# EAGLE design SonicScrewdriver-R2 (EAGLE 6.5.0)
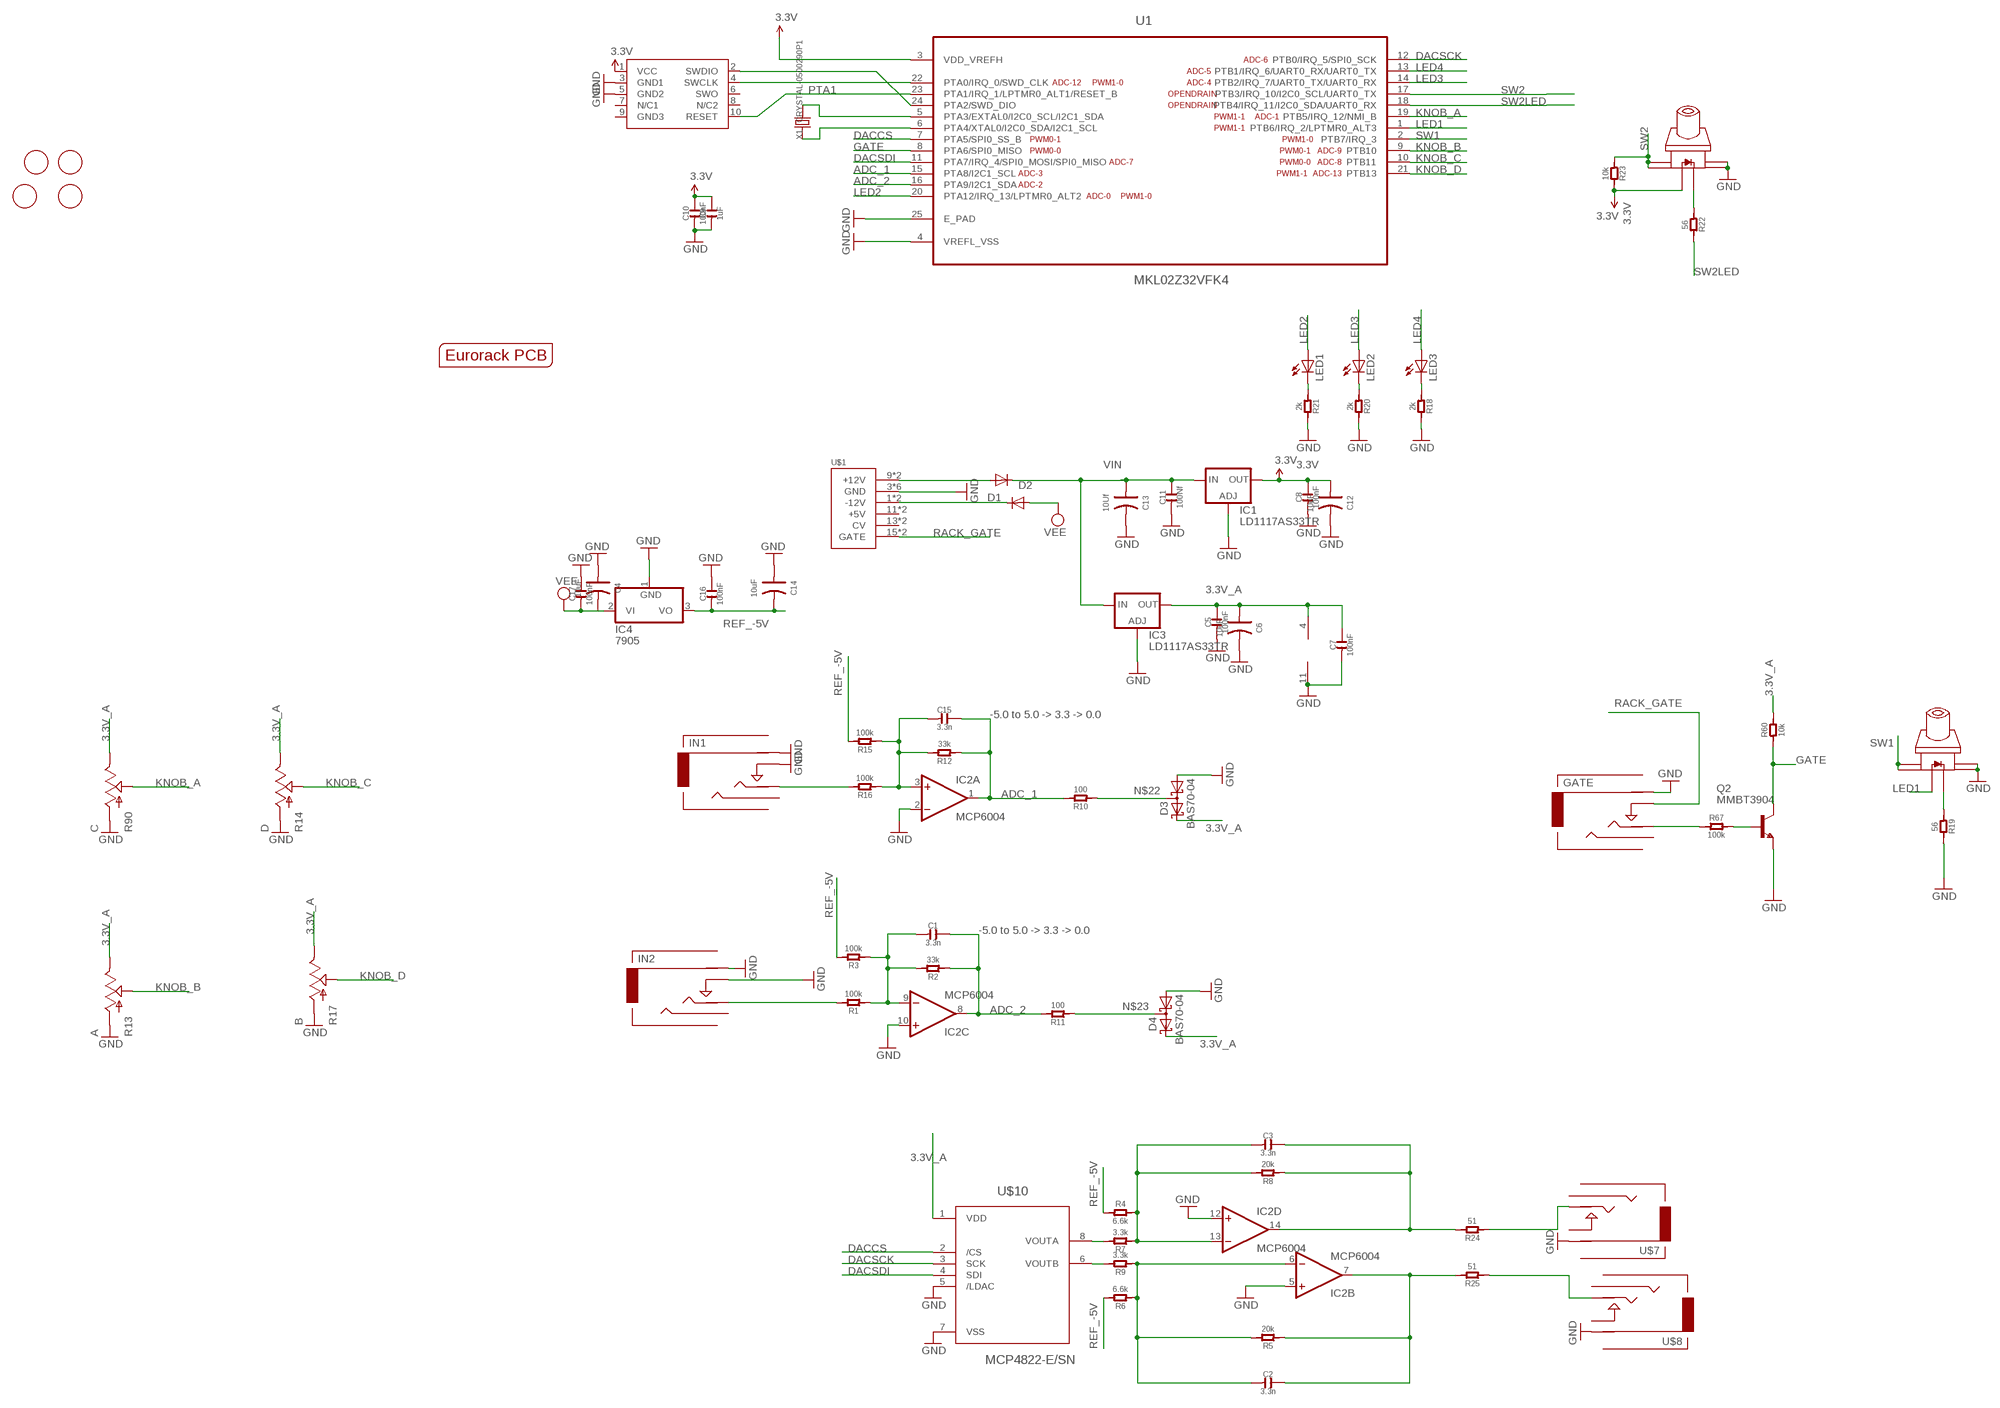
[diagram p0: schematic, sheet 1]

## Parts
C1  3.3n  C-0603  [C0603]
C2  3.3n  C-0603  [C0603]
C3  3.3n  C-0603  [C0603]
C4  10uF  C-POLAR-A  [AVX-A]
C5  100nF  C-0603  [C0603]
C6  10uF  C-POLAR-A  [AVX-A]
C7  100nF  C-0603  [C0603]
C8  100nF  C-0603  [C0603]
C9  1uF  C-0603  [C0603]
C10  100nF  C-0603  [C0603]
C11  100Nf  C-0603  [C0603]
C12  10uF  C-POLAR-A  [AVX-A]
C13  10Uf  C-POLAR-A  [AVX-A]
C14  10uF  C-POLAR-A  [AVX-A]
C15  3.3n  C-0603  [C0603]
C16  100nF  C-0603  [C0603]
C17  100nF  C-0603  [C0603]
D1  1N5819HW  DIODE-SOD123  [SOD123]
D2  1N5819HW  DIODE-SOD123  [SOD123]
D3  BAS70-04  [SOT23]
D4  BAS70-04  [SOT23]
GATE  Gate  AUDIO-JACKINPUT  [3.5MM-JACK-SWITCH-13MM-INPUT]
IC1  LD1117AS33TR  [SOT223]
IC2  MCP6004  TL074D  [SO14]
IC3  LD1117AS33TR  [SOT223]
IC4  7905  7905T  [TO220H]
IN1  In 2  AUDIO-JACKINPUT  [3.5MM-JACK-SWITCH-13MM-INPUT]
IN2  In 1  AUDIO-JACKINPUT  [3.5MM-JACK-SWITCH-13MM-INPUT]
LED1  LED3MM  [LED3MM]
LED2  LED3MM  [LED3MM]
LED3  LED3MM  [LED3MM]
Q2  MMBT3904  MMBT3904LT1-NPN-SOT23-BEC  [SOT23-BEC]
R1  100k  R-0603  [R0603]
R2  33k  R-0603  [R0603]
R3  100k  R-0603  [R0603]
R4  6.6k  R-0603  [R0603]
R5  20k  R-0603  [R0603]
R6  6.6k  R-0603  [R0603]
R7  3.3k  R-0603  [R0603]
R8  20k  R-0603  [R0603]
R9  3.3k  R-0603  [R0603]
R10  100  R-0603  [R0603]
R11  100  R-0603  [R0603]
R12  33k  R-0603  [R0603]
R13  A  POTZEPHPOT  [OG-POTS_ALPS_POT_VERTICAL]
R14  D  POTZEPHPOT  [OG-POTS_ALPS_POT_VERTICAL]
R15  100k  R-0603  [R0603]
R16  100k  R-0603  [R0603]
R17  B  POTZEPHPOT  [OG-POTS_ALPS_POT_VERTICAL]
R18  2k  R-0603  [R0603]
R19  56  R-0603  [R0603]
R20  2k  R-0603  [R0603]
R21  2k  R-0603  [R0603]
R22  56  R-0603  [R0603]
R23  10k  R-0603  [R0603]
R24  51  R-0603  [R0603]
R25  51  R-0603  [R0603]
R60  10k  R-0603  [R0603]
R67  100k  R-0603  [R0603]
R90  C  POTZEPHPOT  [OG-POTS_ALPS_POT_VERTICAL]
SWD1  CORTEX_SWD  [M50-3600542]
U1  MKL02Z32VFK4  [QFN50P400X400X100-25N]
U$1  POWER  [POWER_16]
U$2  EURORACK_PCB8HP  [EURORACK8HPPCB]
U$3  SWITCH_W_LED_PB6149L-X-102WHITE  [PB6149L]
U$4  FIDUCIAL  [FIDUCIAL_1MM]
U$5  FIDUCIAL  [FIDUCIAL_1MM]
U$6  SWITCH_W_LED_PB6149L-X-102WHITE  [PB6149L]
U$7  Out 2  AUDIO-JACKOUTPUT  [3.5MM-JACK-SWITCH-13MM-OUTPUT]
U$8  Out 1  AUDIO-JACKOUTPUT  [3.5MM-JACK-SWITCH-13MM-OUTPUT]
U$9  FIDUCIAL  [FIDUCIAL_1MM]
U$10  MCP4822-E/SN  [SOIC8-N_MC]
U$11  FIDUCIAL  [FIDUCIAL_1MM]
X1  CRYSTAL-0500290P1  [2P-SMD-5.0X3.2]

## Nets
3.3V: C8.2 C9.2 C10.2 C12.+ IC1.2(OUT) IC1.4(OUT) R23.2 SWD1.1(VCC) U1.3(VDD_VREFH) U$3.LEDPOS(POS)
3.3V_A: C5.2 C6.+ C7.2 D3.2(C2) D4.2(C2) IC2.4(P:V+) IC3.2(OUT) IC3.4(OUT) R13.P$1(E) R14.P$1(E) R17.P$1(E) R60.2 R90.P$1(E) U$10.1(VDD)
ADC_1: C15.2 IC2.1(A:OUT) R10.2 R12.1 U1.15(PTA8/I2C1_SCL)
ADC_2: C1.2 IC2.8(C:OUT) R2.1 R11.2 U1.16(PTA9/I2C1_SDA)
DACCS: U1.7(PTA5/SPI0_SS_B) U$10.2(/CS)
DACSCK: U1.12(PTB0/IRQ_5/SPI0_SCK) U$10.3(SCK)
DACSDI: U1.11(PTA7/IRQ_4/SPI0_MOSI/SPI0_MISO) U$10.4(SDI)
GATE: Q2.C R60.1 U1.8(PTA6/SPI0_MISO)
GND: C4.+ C5.1 C6.- C7.1 C8.1 C9.1 C10.1 C11.1 C12.- C13.- C14.+ C16.2 C17.2 D3.1(A1) D4.1(A1) GATE.RING@1(RING) GATE.RING@2(RING) IC1.1(ADJ) IC2.2(A:-IN) IC2.5(B:+IN) IC2.10(C:+IN) IC2.11(P:V-) IC2.12(D:+IN) IC3.1(ADJ) IC4.1(GND) IN1.RING@1(RING) IN1.RING@2(RING) IN1.SWITCH@1(SWITCH) IN1.SWITCH@2(SWITCH) IN2.RING@1(RING) IN2.RING@2(RING) IN2.SWITCH@1(SWITCH) IN2.SWITCH@2(SWITCH) Q2.E R13.P$3(A) R14.P$3(A) R17.P$3(A) R18.2 R19.2 R20.2 R21.2 R90.P$3(A) SWD1.3(GND1) SWD1.5(GND2) U1.4(VREFL_VSS) U1.25(E_PAD) U$1.3(GND) U$1.4(GND) U$1.5(GND) U$1.6(GND) U$1.7(GND) U$1.8(GND) U$3.3 U$3.4 U$6.3 U$6.4 U$7.RING@1(RING) U$7.RING@2(RING) U$8.RING@1(RING) U$8.RING@2(RING) U$10.5(/LDAC) U$10.7(VSS)
KNOB_A: R90.P$2(S) U1.19(PTB5/IRQ_12/NMI_B)
KNOB_B: R13.P$2(S) U1.9(PTB10)
KNOB_C: R14.P$2(S) U1.10(PTB11)
KNOB_D: R17.P$2(S) U1.21(PTB13)
LED1: U1.1(PTB6/IRQ_2/LPTMR0_ALT3) U$6.LEDPOS(POS)
LED2: LED1.A U1.20(PTA12/IRQ_13/LPTMR0_ALT2)
LED3: LED2.A U1.14(PTB2/IRQ_7/UART0_TX/UART0_RX)
LED4: LED3.A U1.13(PTB1/IRQ_6/UART0_RX/UART0_TX)
N$1: U1.5(PTA3/EXTAL0/I2C0_SCL/I2C1_SDA) X1.2
N$2: U1.6(PTA4/XTAL0/I2C0_SDA/I2C1_SCL) X1.1
N$3: IN1.TIP@1(TIP) IN1.TIP@2(TIP) R16.2
N$4: C15.1 IC2.3(A:+IN) R12.2 R15.1 R16.1
N$5: SWD1.4(SWCLK) U1.22(PTA0/IRQ_0/SWD_CLK)
N$6: IN2.TIP@1(TIP) IN2.TIP@2(TIP) R1.2
N$7: SWD1.2(SWDIO) U1.24(PTA2/SWD_DIO)
N$8: C1.1 IC2.9(C:-IN) R1.1 R2.2 R3.1
N$9: C2.1 IC2.6(B:-IN) R5.2 R6.1 R9.1
N$10: C3.1 IC2.13(D:-IN) R4.2 R7.1 R8.2
N$11: R7.2 U$10.8(VOUTA)
N$12: R9.2 U$10.6(VOUTB)
N$13: D1.A U$1.9(+12V) U$1.10(+12V)
N$14: R19.1 U$6.LEDNEG(NEG)
N$15: LED3.K(C) R18.1
N$16: LED2.K(C) R20.1
N$17: LED1.K(C) R21.1
N$18: C3.2 IC2.14(D:OUT) R8.1 R24.2
N$19: R22.1 U$3.LEDNEG(NEG)
N$20: R25.1 U$8.TIP@1(TIP) U$8.TIP@2(TIP)
N$21: R24.1 U$7.TIP@1(TIP) U$7.TIP@2(TIP)
N$22: D3.3(C1A2) R10.1
N$23: D4.3(C1A2) R11.1
N$24: C2.2 IC2.7(B:OUT) R5.1 R25.2
N$43: GATE.TIP@1(TIP) GATE.TIP@2(TIP) R67.1
N$64: D2.C U$1.1(-12V) U$1.2(-12V)
N$66: Q2.B R67.2
PTA1: SWD1.10(RESET) U1.23(PTA1/IRQ_1/LPTMR0_ALT1/RESET_B)
RACK_GATE: GATE.SWITCH@1(SWITCH) GATE.SWITCH@2(SWITCH) U$1.15(GATE) U$1.16(GATE)
REF_-5V: C14.- C16.1 IC4.3(VO) R3.2 R4.1 R6.2 R15.2
SW1: U1.2(PTB7/IRQ_3) U$6.1 U$6.2
SW2: R23.1 U1.17(PTB3/IRQ_10/I2C0_SCL/UART0_TX) U$3.1 U$3.2
SW2LED: R22.2 U1.18(PTB4/IRQ_11/I2C0_SDA/UART0_RX)
VEE: C4.- C17.1 D2.A IC4.2(VI)
VIN: C11.2 C13.+ D1.C IC1.3(IN) IC3.3(IN)
Unconnected: GATE.SECOND@1(SECOND) GATE.SECOND@2(SECOND) IN1.SECOND@1(SECOND) IN1.SECOND@2(SECOND) IN2.SECOND@1(SECOND) IN2.SECOND@2(SECOND) SWD1.6(SWO) SWD1.7(N/C1) SWD1.8(N/C2) SWD1.9(GND3) U$1.11(+5V) U$1.12(+5V) U$1.13(CV) U$1.14(CV) U$7.SECOND@1(SECOND) U$7.SECOND@2(SECOND) U$7.SWITCH@1(SWITCH) U$7.SWITCH@2(SWITCH) U$8.SECOND@1(SECOND) U$8.SECOND@2(SECOND) U$8.SWITCH@1(SWITCH) U$8.SWITCH@2(SWITCH)

## Notes on the sheet
- -5.0 to 5.0 -> 3.3 -> 0.0
- -5.0 to 5.0 -> 3.3 -> 0.0

## Library data of the parts
C1-C3 C5 C7-C11 C15-C17 = OPL:C*
C4 C6 C12-C14 = OPL:C-POLAR*
D1 D2 = diode:DIODE-: DIODE
D3 D4 = diode:BAS70-04: Silicon Schottky Diodes General-purpose diode for high-speed switching
GATE IN1 IN2 U$7 U$8 = EurorackModularParts:AUDIO-JACK: Switching Mono 3.5mm Audio Jack from Erthenvar.
IC1 IC3 = ld-components:LD1117A?*: Low drop fixed and adjustable positive voltage regulators 1 A Source: http://www.st.com/stonline/products/literature/ds/7194/ld1117axx.pdf
IC2 = gm-ics:TL074: OP AMP
IC4 = linear:79*: Negative VOLTAGE REGULATOR
LED1-LED3 = SparkFun-LED:LED: LEDs Standard schematic elements and footprints for 5mm, 3mm, 1206, and 0603 sized LEDs. 5mm - Spark Fun Electronics SKU : COM-00529 (and others)
Q2 = transistor:*-NPN-: NPN Transistror BF959 corrected 2008.03.06
R1-R12 R15 R16 R18-R25 R60 R67 = OPL:R*
R13 R14 R17 R90 = EurorackModularParts:POT
SWD1 = carrilib with jtags:CORTEX_SWD: .05" Cortex M Connector in SWD mode Manufacturer: Generic Part Number: Cortex M SWD Notes: I use Harwin M50-3600542 connectors
U1 = FarnellThings:MKL02Z32VFK4: IC, MCU, 32BIT, CORTEX M0+, 48MHZ, QFN-24; MPN: MKL02Z32VFK4; OC_FARNELL: 2321481; OC_NEWARK: 61W9887; PACKAGE: QFN-24; SUPPLIER: FREESCALE SEMICONDUCTOR
U$1 = eurorack:POWER
U$2 = EurorackModularParts:EURORACK_PCB
U$3 U$6 = zephod-components:SWITCH_W_LED_PB6149L-X-102
U$4 U$5 U$9 U$11 = adafruit:FIDUCIAL: For use by pick and place machines to calibrate the vision/machine, 1mm By microbuilder.eu
U$10 = FarnellThings:MCP4822-E/SN: 12 Bit DAC; DESCRIPTION: 12 Bit DAC; MPN: MCP4822-E/SN; OC_FARNELL: 1439414; OC_NEWARK: 31K2975; PACKAGE: SOIC-8; SUPPLIER: Microchip
X1 = OPL:CRYSTAL*

## Board
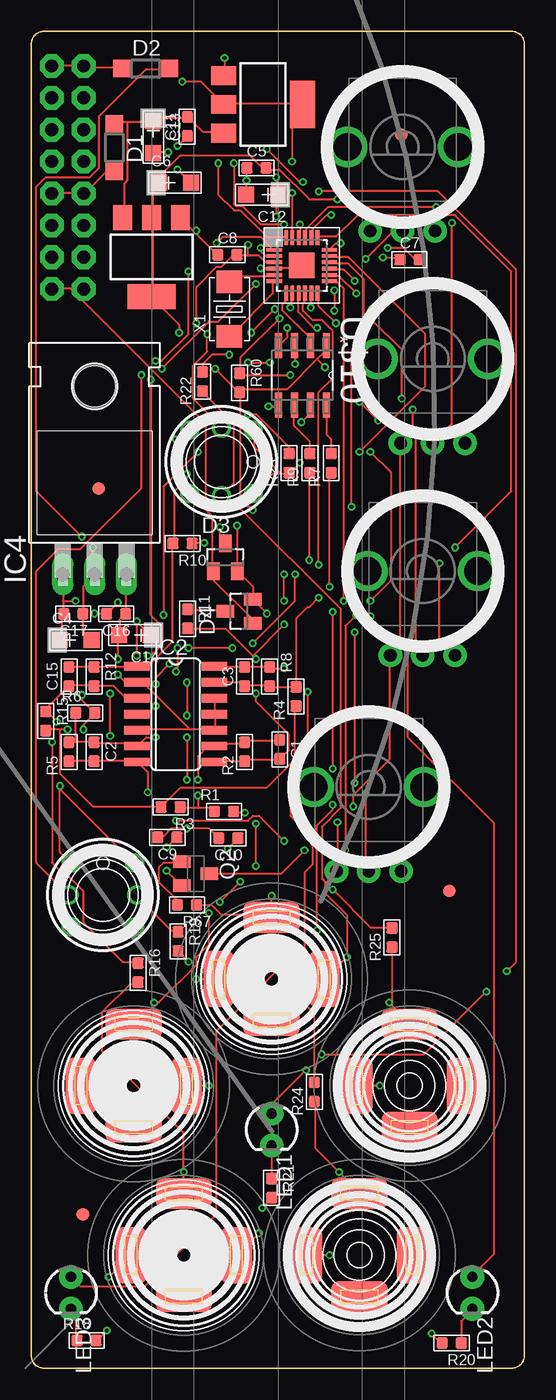
[diagram p1: board, top side]
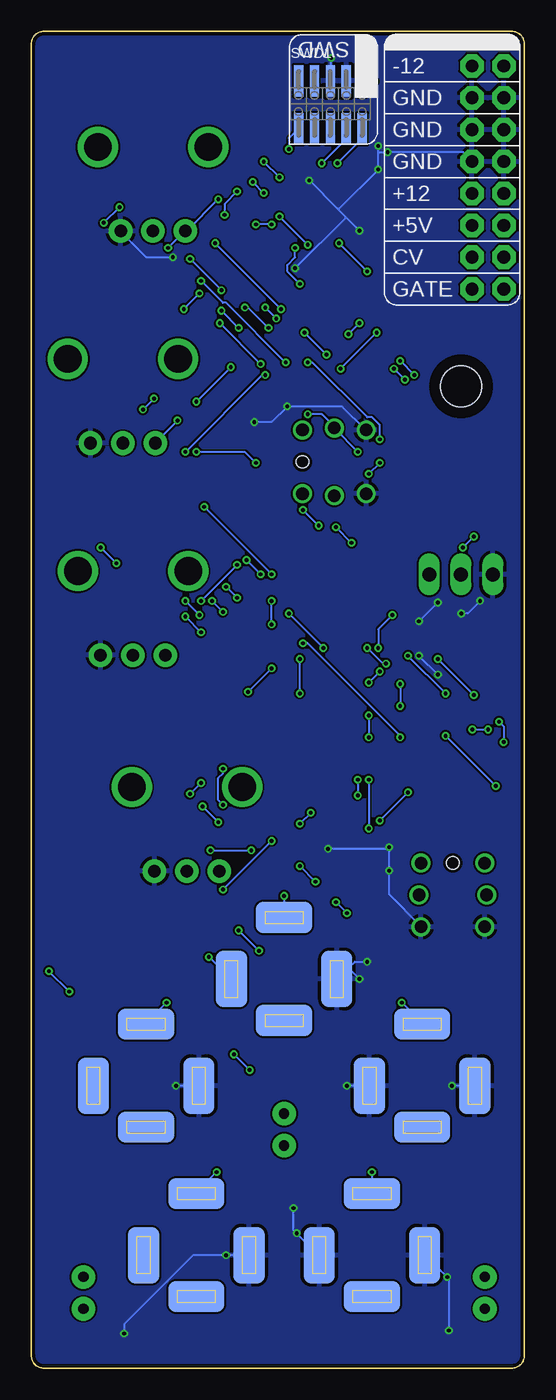
[diagram p2: board, bottom side, seen from below]

Size 39.3 x 106.5 mm. Coordinates in mm from the lower left corner, seen from the top.
Copper layers (1*16): Top 0.035mm / dielectric 1.5mm / Bottom 0.035mm
Design rules "ITEADstudio_DRC": minimum track width 6mil, minimum drill 12mil, track to track 6mil, track to pad 6mil, pad to pad 6mil, via to via 6mil, smd to smd 0mil, copper to edge 10mil, drill to drill 10mil, minimum pad ring 10mil, minimum via ring 6mil, stop-mask expansion 2mil, vias tented up to drill 100mil, thermal gap 10mil

### Footprints (pad centres in the part's own frame; a part is rotated, then mirrored left to right if it is on the bottom)
C0603 = smd 0.889 x 0.889: 1 -0.762,0; 2 0.762,0
AVX-A = smd 1.27 x 1.27: + -1.27,0; - 1.27,0
SOD123 = smd 1.4 x 1.4: A 1.9,0; C -1.9,0
SOT23 = smd 1 x 1.4: 1 -0.95,-1.1; 2 0.95,-1.1; 3 0,1.1
3.5MM-JACK-SWITCH-13MM-INPUT = smd 2.5 x 4.5: RING@1 -4.2,0; SWITCH@1 4.2,0 | smd 2.5 x 4.5 bottom: RING@2 -4.2,0; SWITCH@2 4.2,0 | smd 4.5 x 2.5: SECOND@1 0,-3.3; TIP@1 0,4.9 | smd 4.5 x 2.5 bottom: SECOND@2 0,-3.3; TIP@2 0,4.9
SOT223 = smd 1.5 x 2: 1 -2.3,-3.15; 2 0,-3.15; 3 2.3,-3.15 | smd 3.8 x 2: 4 0,3.15
SO14 = smd 0.66 x 2.032: 1 -3.81,-3.073; 2 -2.54,-3.073; 3 -1.27,-3.073; 4 0,-3.073; 5 1.27,-3.073; 6 2.54,-3.073; 7 3.81,-3.073; 8 3.81,3.073; 9 2.54,3.073; 10 1.27,3.073; 11 0,3.073; 12 -1.27,3.073; 13 -2.54,3.073; 14 -3.81,3.073
TO220H = drill 1.118 long: 1 -2.54,-10.16; 2 0,-10.16; 3 2.54,-10.16 | hole 3.302: 0,4.826
LED3MM = drill 0.813 pad 1.88: A -1.27,0; K 1.27,0
SOT23-BEC = smd 1 x 1.4: B -0.95,-1.1; C 0,1.1; E 0.95,-1.1
R0603 = smd 0.889 x 0.889: 1 -0.762,0; 2 0.762,0
OG-POTS_ALPS_POT_VERTICAL = drill 1 pad 1.88: P$1 -2.58,-6.7; P$2 0,-6.7; P$3 2.58,-6.7 | drill 2.2 pad 3.175: P$4 4.4,0; P$5 -4.4,0
M50-3600542 = smd 0.75 x 2.5: 1 -2.54,-1.81; 2 -2.54,2; 3 -1.27,-1.81; 4 -1.27,2; 5 0,-1.81; 6 0,2; 7 1.27,-1.81; 8 1.27,2; 9 2.54,-1.81; 10 2.54,2
QFN50P400X400X100-25N = smd 1.2 x 0.3: 1 -2.2,1.245; 2 -2.2,0.762; 3 -2.2,0.254; 4 -2.2,-0.254; 5 -2.2,-0.762; 6 -2.2,-1.245; 13 2.2,-1.245; 14 2.2,-0.762; 15 2.2,-0.254; 16 2.2,0.254; 17 2.2,0.762; 18 2.2,1.245 | smd 0.3 x 1.2: 7 -1.245,-2.2; 8 -0.762,-2.2; 9 -0.254,-2.2; 10 0.254,-2.2; 11 0.762,-2.2; 12 1.245,-2.2; 19 1.245,2.2; 20 0.762,2.2; 21 0.254,2.2; 22 -0.254,2.2 | smd 0.305 x 1.2: 23 -0.762,2.2; 24 -1.245,2.2 | smd 2.032 x 2.032: 25 0,0
POWER_16 = drill 1.016 pad 1.88 octagon: 1 -6.35,-1.27; 2 -6.35,1.27; 3 -3.81,-1.27; 4 -3.81,1.27; 5 -1.27,-1.27; 6 -1.27,1.27; 7 1.27,-1.27; 8 1.27,1.27; 9 3.81,-1.27; 10 3.81,1.27; 11 6.35,-1.27; 12 6.35,1.27; 13 8.89,-1.27; 14 8.89,1.27; 15 11.43,-1.27; 16 11.43,1.27
PB6149L = drill 1: 1 2.54,2.54; 2 2.54,-2.54; 3 -2.54,2.54; 4 -2.54,-2.54; LEDNEG 0,-2.7; LEDPOS 0,2.7 | hole 1: 2.54,0
FIDUCIAL_1MM = smd 1 x 1: 1 0,0
3.5MM-JACK-SWITCH-13MM-OUTPUT = smd 2.5 x 4.5: RING@1 -4.2,0; SWITCH@1 4.2,0 | smd 2.5 x 4.5 bottom: RING@2 -4.2,0; SWITCH@2 4.2,0 | smd 4.5 x 2.5: SECOND@1 0,-3.3; TIP@1 0,4.9 | smd 4.5 x 2.5 bottom: SECOND@2 0,-3.3; TIP@2 0,4.9
SOIC8-N_MC = smd 1.981 x 0.559: 1 -2.362,1.905; 2 -2.362,0.635; 3 -2.362,-0.635; 4 -2.362,-1.905; 5 2.362,-1.905; 6 2.362,-0.635; 7 2.362,0.635; 8 2.362,1.905
2P-SMD-5.0X3.2 = smd 1.778 x 2.032: 1 -2.159,0; 2 2.159,0

### Placement (x,y rotation side)
C1  19.8,49.3 270 top
C2  5,49.1 270 top
C3  17,55.1 90 top
C4  3.55,58 0 top
C5  17.94,95.62 0 top
C6  11.45,94.44 0 top
C7  30.15,88.31 0 top
C8  15.62,88.7 0 top
C9  10.84,42.29 180 top
C10  15.7,42.23 180 top
C11  12.43,98.92 90 top
C12  18.37,93.49 180 top
C13  9.72,98.08 270 top
C14  8.25,58.4 180 top
C15  3,55.1 90 top
C16  6.75,60.1 180 top
C17  3.35,60.1 180 top
D1  6.61,97.23 270 top
D2  9.11,103.54 0 top
D3  15.45,64.6 0 top
D4  16.55,60.3 90 top
GATE  19.15,31 0 top
IC1  18.47,100.68 270 top
IC2  11.5,52.1 270 top
IC3  9.58,88.52 180 top
IC4  5.05,73.4 0 top
IN1  12.15,9 0 top
IN2  8.15,22.5 0 top
LED1  19.15,19 270 top
LED2  35.15,6 270 top
LED3  3.15,6 270 top
Q2  13.1,39.4 270 top
R1  15.35,44.35 0 top
R2  17,49.1 90 top
R3  11.1,44.7 180 top
R4  21.1,53.5 90 top
R5  3,49.1 90 top
R6  4.3,52.2 0 top
R7  23.9,72.1 90 top
R8  19,55.1 270 top
R9  22.2,72.1 90 top
R10  12.05,65.7 180 top
R11  12.45,59.7 270 top
R12  5,55.1 270 top
R13  29.6,97.3 0 top
R14  26.9,46.3 0 top
R15  1.15,51.55 270 top
R16  8.5,31.5 270 top
R17  32,80.4 0 top
R18  4.4,2.2 0 top
R19  11.7,34 270 top
R20  33.5,2 180 top
R21  19.15,14.35 270 top
R22  13.65,78.6 90 top
R23  20.55,72.1 90 top
R24  22.55,22 90 top
R25  28.75,34.3 90 top
R60  16.6,78.5 270 top
R67  12.4,36.9 180 top
R90  31.2,63.5 0 top
SWD1  15.46,100.75 180 bottom
U1  21.56,87.85 0 top
U$1  2.9,97.4 270 bottom
U$2  -0.5,0 0 top
U$3  15.15,72.2 0 top
U$4  29.51,98.28 0 top
U$5  4.11,12.26 0 top
U$6  5.7,37.7 90 top
U$7  26.15,9 0 top
U$8  30.15,22.5 0 top
U$9  33.32,38 0 top
U$10  21.6,79.1 270 top
U$11  5.38,70.09 0 top
X1  15.79,84.37 90 top

### Tracks (layer width: path | path; a pad name or v marks a point on that pad's centre or on a via)
3.3V  (via drill 0.3)
  Top 0.152: 17.27,88.62 18.15,88.62 18.65,88.12 19.27,88.12 U1.3 | 17.27,88.62 16.4,88.62 C8.2 16.27,88.62 16.02,88.62 15.15,87.75 14.77,87.75 13.15,86.12 v13.15,83.25 | v19.52,91.75 19.52,93.38 C12.+ 19.52,93.5 v19.52,94.88 | 17.27,88.62 v17.27,89.5 | 20.77,100.75 21.52,100.75 IC1.4 20.77,100.75 | 20.77,100.75 15.4,100.75 IC1.2 15.27,100.75 13.52,102.5 v12.02,102.5 | 20.77,100.75 v20.77,96.12 | v14.02,82.38 14.02,81 12.9,79.88 12.9,77.25 15.15,75 U$3.LEDPOS | C9.2 10.15,42.38 10.52,42.38 11.15,43 v12.4,43 14.15,43 14.9,42.25 C10.2 | v17.27,76 17.9,76 20.52,73.38 20.52,72.88 R23.2 | v12.4,50.25 v12.4,46.88 | v12.4,54.62 v12.4,52 | v11.52,55.5 11.52,55.75 11.65,55.88 v11.65,57.38 | v10.52,60 10.52,70.25 v13.27,73
  Bottom 0.152: v17.27,89.5 v19.52,91.75 | v12.02,102.5 12.9,102.5 SWD1.1 | v20.77,96.12 v19.52,94.88 | v14.02,82.38 v13.15,83.25 | v17.27,76 16.15,76 15.15,75 U$3.LEDPOS 15.15,74.88 v13.27,73 | v12.4,46.88 v12.4,43 | v12.4,52 v12.4,50.25 | v11.52,55.5 v12.4,54.62 | v11.65,57.38 11.65,58.88 v10.52,60
3.3V_A  (via drill 0.3)
  Top 0.152: v28.4,89.25 29.65,89.25 30.52,88.38 30.9,88.38 C7.2 | v24.4,93.12 22.15,93.12 19.77,95.5 18.77,95.5 C5.2 18.65,95.62 18.4,95.62 17.4,96.62 11.9,96.62 10.27,95 10.27,94.5 C6.+ 10.15,94.38 9.65,93.88 9.65,91.75 IC3.2 9.65,91.62 9.65,85.38 IC3.4 9.65,85.25 11.77,83.12 v11.77,82.5 | v14.65,79.62 16.27,78 | 16.27,78 16.52,77.75 R60.2 | v9.9,52.75 9.27,52.12 8.52,52.12 IC2.4 | v9.9,54.5 9.9,55 v11.02,56.12 | v16.02,57.38 v12.52,57.38 | v18.77,60.12 D4.2 17.65,62.25 D3.2 v16.4,67.12 | v24.4,43.5 24.4,39.62 R14.P$1 | v25.65,44.75 25.65,45.62 28.52,48.5 28.52,56.75 R90.P$1 28.65,56.88 29.4,57.62 29.4,73.62 R17.P$1 | v17.65,68.38 17.4,68.62 17.27,68.62 16.65,69.25 16.65,77.62 R60.2 | 22.77,80.38 20.4,78 16.27,78 | 22.77,80.38 23.4,81 23.4,81.38 U$10.1 | 16.27,78 R60.2 | v23.4,79.75 22.77,80.38 | v27.65,75.5 v26.15,77
  Bottom 0.152: v28.4,89.25 27.02,90.62 R13.P$1 26.9,90.62 v24.4,93.12 | v11.77,82.5 v14.65,79.62 | v9.9,54.5 v9.9,52.75 | v11.02,56.12 11.27,56.12 v12.52,57.38 | v18.77,60.12 v16.02,57.38 | v25.65,44.75 v24.4,43.5 | v17.65,68.38 v16.4,67.12 | v26.15,77 v23.4,79.75 | v27.65,75.5 29.4,73.75 R17.P$1
ADC_1  (via drill 0.3)
  Top 0.152: C15.2 3.02,55.88 4.9,55.88 R12.1 5.02,55.88 8.4,55.88 IC2.1 8.52,56 9.4,56 11.27,57.88 11.27,65.62 R10.2 11.4,65.75 11.4,69.88 12.4,70.88 v12.4,71.25 | v25.77,86.62 24.9,87.5 23.77,87.5 U1.15 | v17.27,80.12 v19.02,80.12 | v11.52,72.12 v11.52,74
  Bottom 0.152: v25.77,86.62 24.02,84.88 23.77,84.88 v19.02,80.12 | v17.27,80.12 16.9,80.12 12.52,75.75 12.15,75.75 11.52,75.12 v11.52,74 | v12.4,71.25 v11.52,72.12
ADC_2  (via drill 0.3)
  Top 0.152: IC2.8 14.65,48.38 16.9,48.38 R2.1 17.02,48.38 17.15,48.5 19.77,48.5 C1.2 19.9,48.62 20.52,49.25 20.52,50.5 17.9,53.12 v17.9,53.75 | v17.9,56.5 17.65,56.75 | 17.65,56.75 15.52,58.88 12.52,58.88 R11.2 | v25.52,68.62 25.52,81 26.52,82 26.52,86.75 25.27,88 23.77,88 U1.16 | v20.15,61.12 v20.15,63.25 | 17.65,56.75 v20.15,59.25
  Bottom 0.152: v17.9,53.75 v17.9,56.5 | v20.15,63.25 v25.52,68.62 | v20.15,59.25 v20.15,61.12
DACCS
  Top 0.152: U1.7 20.27,85.62 20.27,85 20.02,84.75 20.02,84.25 22.15,82.12 22.15,81.5 U$10.2
DACSCK  (via drill 0.3)
  Top 0.152: v24.27,83.25 22.9,84.62 22.9,85.62 U1.12 | v21.02,80 21.02,81.38 U$10.3
  Bottom 0.152: v21.02,80 v24.27,83.25
DACSDI  (via drill 0.3)
  Top 0.152: v22.27,84.5 22.27,85.62 U1.11 | v20.4,82.88 20.4,82.12 19.77,81.5 U$10.4
  Bottom 0.152: v22.27,84.5 22.02,84.5 v20.4,82.88
GATE  (via drill 0.3)
  Top 0.152: v19.77,83.62 16.65,80.5 16.65,79.38 R60.1 16.65,79.25 16.77,79.12 v20.65,79.12 | v20.65,84.5 20.65,84.88 20.77,85 20.77,85.62 U1.8 | v21.77,41.25 19.9,39.38 14.27,39.38 Q2.C | v25.02,41.25 25.02,59.12 v25.9,60 | v27.02,61.12 28.65,62.75 28.65,71.38 v27.02,73
  Bottom 0.152: v20.65,84.5 v19.77,83.62 | v25.02,41.25 v21.77,41.25 | v27.02,61.12 v25.9,60 | v27.02,73 20.9,79.12 v20.65,79.12
GND  (via drill 0.3)
  Top 0.152: v11.65,97.38 12.4,98.12 C11.1 | v11.65,95.5 12.65,94.5 C6.- | v10.9,96.88 9.77,96.88 C13.- | U1.25 21.52,87.75 21.4,87.62 19.4,87.62 U1.4 19.27,87.62 v18.27,87.62 | C5.1 17.15,95.5 v17.15,94.62 17.15,93.5 C12.- | 13.02,90.5 11.9,91.62 IC3.1 | 13.02,90.5 14.77,88.75 C8.1 | 13.02,90.5 v13.15,90.62 | v10.77,41.5 11.52,42.25 C9.1 | v10.77,39.62 11.9,38.5 Q2.E | v15.65,41.38 16.4,42.12 C10.1 | IC2.12 14.65,53.25 14.65,52.12 IC2.11 14.65,52 14.65,50.88 IC2.10 14.52,50.88 12.65,50.88 | v6.02,3 5.27,2.25 R18.2 | v12.52,32.38 11.77,33.12 R19.2 | v18.4,12.75 19.15,13.5 R21.2 | v31.9,2.75 32.65,2 R20.2 | v28.02,88.5 29.27,88.45 C7.1 | v18.9,76.62 19.65,76.62 U$10.5 | v21.52,75.38 22.15,76 22.15,76.62 U$10.7 | v15.4,104.38 15.4,103 IC1.1 | v5.77,22.5 IN2.RING@2 | v6.15,7.25 7.9,9 IN1.RING@2 | v14.15,22.5 IN2.SWITCH@2 | v13.15,31 GATE.RING@2 | v18.15,10.75 16.4,9 IN1.SWITCH@2 | v23.77,9 U$7.RING@2 | v27.77,22.5 U$8.RING@2 | 12.65,50.88 8.52,50.88 IC2.5 | 12.65,50.88 8.9,54.62 8.52,54.62 IC2.2 8.4,54.75 7.4,54.75 v6.9,55.25 | 2.52,61.12 2.52,63.12 IC4.1 | 2.52,61.12 2.52,60.12 C17.2 2.52,60 2.4,59.88 2.4,58 C4.+ | v5.02,60.12 5.9,60.12 C16.2 6.02,60.12 v6.9,61 | 2.52,61.12 v3.52,61.12 | C14.+ 9.4,58.5 v8.4,59.5 v8.4,56.75 | U$3.4 12.65,69.62 14.4,67.88 14.4,63.5 D3.1 14.52,63.5 14.52,62.75 17.65,59.62 D4.1
  Bottom 0.152: 11.65,96.88 v11.65,95.5 14.77,92.38 14.9,92.38 | 11.65,96.88 v11.65,97.38 | 11.65,96.88 v10.9,96.88 4.9,96.88 4.27,96.25 U$1.7 | v13.15,90.62 14.15,91.62 | 14.15,91.62 14.9,92.38 | 14.9,92.38 v17.15,94.62 | v18.27,87.62 14.27,91.62 14.15,91.62 | 10.77,41.38 v10.77,39.62 10.77,37.75 8.27,35.25 U$6.4 | 10.77,41.38 v15.65,41.38 | 10.77,41.38 v10.77,41.5 | v6.02,3 6.02,7.12 v6.15,7.25 7.9,9 IN1.RING@2 | v12.52,32.38 13.52,32.38 14.02,31.88 | 14.02,31.88 14.9,31 GATE.RING@2 14.02,31.88 | v18.4,12.75 18.4,11 v18.15,10.75 16.4,9 IN1.SWITCH@2 | v31.9,2.75 31.9,3.5 26.4,9 v23.77,9 U$7.RING@2 | v28.02,88.5 30.15,88.5 32.15,90.5 R13.P$3 | U$3.3 12.65,74.75 14.52,76.62 v18.9,76.62 20.15,75.38 v21.52,75.38 | v15.4,104.38 15.4,102.62 SWD1.5 | IN2.RING@2 v5.77,22.5 | IN2.SWITCH@2 v14.15,22.5 | 14.02,31.88 v13.15,31 | U$8.RING@2 v27.77,22.5 | v5.02,60.12 4.52,60.12 v3.52,61.12 | v6.9,61 v8.4,59.5 | v8.4,56.75 v6.9,55.25
  pour Bottom: -1.95,104.7 -1.25,-2 41.65,-2 41.65,107 -1.35,107
KNOB_A  (via drill 0.3)
  Top 0.152: v33.77,65.38 38.27,69.88 38.27,87.38 33.77,91.88 26.02,91.88 24.27,90.12 22.9,90.12 U1.19 | v32.52,64.12 32.52,58.12 R90.P$2
  Bottom 0.152: v32.52,64.12 v33.77,65.38
KNOB_B  (via drill 0.3)
  Top 0.152: v22.77,82.88 22.52,82.88 21.27,84.12 21.27,85.62 U1.9 | v24.15,85.88 v24.15,84.25 | v26.65,88.38 28.77,90.5 29.52,90.5 R13.P$2
  Bottom 0.152: v24.15,84.25 v22.77,82.88 | v26.65,88.38 v24.15,85.88
KNOB_C  (via drill 0.3)
  Top 0.152: v22.9,64 22.9,77.75 24.02,78.88 24.02,82.62 23.15,83.5 22.4,83.5 21.65,84.25 21.65,84.75 21.77,84.88 21.77,85.62 U1.10 | v27.02,59.88 v25.77,61.12 | v25.77,46.62 v25.77,58.62 | v26.65,45.75 26.65,39.75 26.77,39.62 R14.P$2
  Bottom 0.152: v25.77,61.12 v22.9,64 | v25.77,58.62 v27.02,59.88 | v26.65,45.75 v25.77,46.62
KNOB_D  (via drill 0.3)
  Top 0.152: v32.27,92.5 23.65,92.5 21.9,90.75 21.9,90.12 U1.21 | v33.52,91.25 33.52,75.25 32.02,73.75 R17.P$2
  Bottom 0.152: v33.52,91.25 v32.27,92.5
LED1  (via drill 0.3)
  Top 0.152: v14.77,89.62 15.27,90.12 18.27,90.12 19.27,89.12 U1.1 | v12.52,87.38 12.52,82.38 10.4,80.25 v9.9,80.25 | v8.77,79.12 8.77,70.12 3.9,65.25 2.15,65.25 0.4,63.5 0.4,40.25 2.9,37.75 U$6.LEDPOS
  Bottom 0.152: v12.52,87.38 v14.77,89.62 | v8.77,79.12 v9.9,80.25
LED2  (via drill 0.3)
  Top 0.152: v23.9,91.88 23.52,91.88 22.4,90.75 22.4,90.12 U1.20 | v22.9,93.75 32.4,93.75 38.65,87.5 38.65,32.38 v37.9,31.62 | v36.27,30 31.27,25 v23.15,25 | v21.9,23.75 19.15,21 LED1.A
  Bottom 0.152: v23.9,91.88 23.9,92.75 v22.9,93.75 | v36.27,30 v37.9,31.62 | v21.9,23.75 v23.15,25
LED3  (via drill 0.3)
  Top 0.152: v25.9,85.62 24.52,87 23.77,87 U1.14 | v27.15,84.38 27.15,83.5 29.52,81.12 v29.52,77.25 | v30.4,76.38 30.4,74.38 30.65,74.12 30.65,58 30.02,57.38 30.02,50.25 36.9,43.38 36.9,9.12 35.15,7.38 LED2.A
  Bottom 0.152: v27.15,84.38 v25.9,85.62 | v30.4,76.38 v29.52,77.25
LED4  (via drill 0.3)
  Top 0.152: 24.4,86.5 23.77,86.5 U1.13 | 24.4,86.5 24.9,86 v24.9,61.12 | v24.02,47.75 v24.02,60.25 | v24.02,44.88 24.02,44.5 22.77,43.25 v22.77,34.88 | v21.15,33.25 14.77,26.88 14.77,12.25 9.02,6.5 3.9,6.5 3.15,7.25 LED3.A | 24.4,86.5
  Bottom 0.152: v24.02,60.25 v24.9,61.12 | v24.02,47.75 24.02,47.38 24.4,47 24.4,45.25 v24.02,44.88 | v21.15,33.25 v22.77,34.88
N$1
  Top 0.152: U1.5 19.27,87 16.27,87 15.9,86.62 X1.2
N$2
  Top 0.152: U1.6 19.27,86.5 19.27,85.62 15.9,82.25 X1.1
N$3  (via drill 0.3)
  Top 0.152: IN1.TIP@2 v12.15,15.62 12.15,18.75 5.65,25.25 5.65,28.38 7.9,30.62 8.4,30.62 R16.2
  Bottom 0.152: v12.15,15.62 IN1.TIP@2
N$4  (via drill 0.3)
  Top 0.152: v1.65,49.88 1.65,40.25 2.65,39.25 2.9,39.25 4.15,38 4.15,35.5 7.27,32.38 8.4,32.38 R16.1 | 1.15,52.38 v2.02,51.5 | 1.15,52.38 1.15,52.5 2.9,54.25 C15.1 3.02,54.38 4.9,54.38 R12.2 5.02,54.38 6.52,54.38 7.52,53.38 8.4,53.38 IC2.3 | 1.15,52.38 R15.1
  Bottom 0.152: v1.65,49.88 1.65,51.12 v2.02,51.5
N$5  (via drill 0.3)
  Top 0.152: v21.4,91.12 21.4,90.12 U1.22 | v20.15,91.12 18.27,91.12 16.77,92.62 16.27,92.62 16.15,92.75 v16.15,96
  Bottom 0.152: v20.15,91.12 v21.4,91.12 | v16.15,96 14.27,97.88 14.27,98.75 SWD1.4
N$6  (via drill 0.3)
  Top 0.152: v17.02,44.25 16.15,44.25 R1.2 | v17.9,40 v17.9,43.38 | v15.02,37.12 v16.65,38.75 | v14.15,36.25 14.15,33.75 13.15,32.75 13.15,32.12 10.15,29.12 | 10.15,29.12 8.52,27.5 8.15,27.5 IN2.TIP@2 | 10.15,29.12 v9.77,29.12
  Bottom 0.152: v17.9,43.38 v17.02,44.25 | v16.65,38.75 v17.9,40 | v14.15,36.25 v15.02,37.12 | v9.77,29.12 8.15,27.5 IN2.TIP@2
N$7  (via drill 0.3)
  Top 0.152: v14.9,96 14.9,93.5 16.15,92.25 16.65,92.25 18.77,90.12 20.27,90.12 U1.24
  Bottom 0.152: v14.9,96 13.02,97.88 13.02,98.75 SWD1.2
N$8  (via drill 0.3)
  Top 0.152: 13.27,44.62 14.27,44.62 14.52,44.38 R1.1 | 13.27,44.62 11.9,44.62 R3.1 | C1.1 19.77,50 17.15,50 17.02,49.88 R2.2 16.9,49.75 14.77,49.75 14.65,49.62 IC2.9 14.52,49.5 14.02,49.5 13.27,48.75 v13.27,46.88 | v13.27,45.62 13.27,44.62
  Bottom 0.152: v13.27,46.88 v13.27,45.62
N$9  (via drill 0.3)
  Top 0.152: 3.52,49.88 4.9,49.88 C2.1 5.02,49.75 8.65,49.75 | 3.52,49.88 3.02,49.88 R5.2 | 3.52,49.88 3.52,52.12 R6.1 | v22.15,64.38 22.15,71.25 R9.1 | v21.02,63.25 21.02,61.12 v17.65,57.75 | v9.9,50.25 9.15,50.25 8.65,49.75 | 8.65,49.75 8.52,49.62 IC2.6 8.65,49.75
  Bottom 0.152: v21.02,63.25 v22.15,64.38 | v17.65,57.75 17.27,57.75 9.9,50.38 v9.9,50.25
N$10  (via drill 0.3)
  Top 0.152: IC2.13 14.65,54.62 16.65,54.62 16.9,54.38 C3.1 17.02,54.38 18.9,54.38 R8.2 19.02,54.25 21.02,54.25 R4.2 21.15,54.38 21.15,59.75 22.02,60.62 22.15,60.62 v22.9,61.38 | v23.77,62.25 23.77,71.25 R7.1
  Bottom 0.152: v22.9,61.38 v23.77,62.25
N$11
  Top 0.152: R7.2 23.9,74 23.52,74.38 23.52,76.62 U$10.8
N$12
  Top 0.152: R9.2 22.15,72.88 22.15,73.88 20.9,75.12 20.9,76.62 U$10.6
N$13
  Top 0.152: D1.A 6.52,95.25 5.9,95.25 4.27,93.62 U$1.9 4.15,93.62 1.65,93.62 U$1.10
N$14
  Top 0.152: R19.1 11.65,34.88 11.15,34.88 8.4,37.62 U$6.LEDNEG
N$15
  Top 0.152: R18.1 3.52,2.25 3.52,4.25 3.15,4.62 LED3.K
N$16
  Top 0.152: R20.1 34.27,2 34.27,3.75 35.15,4.62 LED2.K
N$17
  Top 0.152: LED1.K R21.1
N$18  (via drill 0.3)
  Top 0.152: v22.02,53.88 22.02,49 20.65,47.62 20.65,44 22.4,42.25 22.4,40.12 21.77,39.5 21.77,29 22.52,28.25 22.52,22.88 R24.2 | v20.15,55.75 19.02,55.75 R8.1 18.9,55.88 17.02,55.88 C3.2 16.9,55.88 14.65,55.88 IC2.14
  Bottom 0.152: v20.15,55.75 v22.02,53.88
N$19
  Top 0.152: U$3.LEDNEG 16.15,70.5 16.15,75.38 15.52,76 15.4,76 13.65,77.75 R22.1
N$20  (via drill 0.3)
  Top 0.152: 28.77,29.12 28.77,28.88 30.15,27.5 U$8.TIP@2 | 28.77,29.12 28.77,33.5 R25.1 | 28.77,29.12 v28.52,29.12
  Bottom 0.152: v28.52,29.12 30.15,27.5 U$8.TIP@2
N$21  (via drill 0.3)
  Top 0.152: R24.1 22.65,21.12 22.65,17.5 v24.52,15.62 26.15,14 U$7.TIP@2
  Bottom 0.152: v24.52,15.62 26.15,14 U$7.TIP@2
N$22  (via drill 0.3)
  Top 0.152: v13.77,65.75 12.9,65.75 R10.1 | v15.02,67 15.02,66.12 D3.3
  Bottom 0.152: v15.02,67 v13.77,65.75
N$23
  Top 0.152: R11.1 12.52,60.38 15.4,60.38 D4.3
N$24  (via drill 0.3)
  Top 0.152: R5.1 3.02,48.38 4.9,48.38 C2.2 5.02,48.38 8.4,48.38 IC2.7 8.52,48.25 9.27,47.5 v9.27,45.88 | v24.02,38.12 27.02,35.12 28.65,35.12 R25.2 | v20.15,42 18.15,44 17.65,44 17.27,43.62 v11.52,43.62
  Bottom 0.152: v20.15,42 v24.02,38.12 | v9.27,45.88 v11.52,43.62
N$43  (via drill 0.3)
  Top 0.152: 19.15,36 19.02,36.12 15.15,36.12 14.4,36.88 13.27,36.88 R67.1 | 19.15,36 v19.15,37.62 | 19.15,36 GATE.TIP@2
  Bottom 0.152: v19.15,37.62 GATE.TIP@2
N$64
  Top 0.152: D2.C 7.15,103.62 4.4,103.62 4.27,103.75 U$1.1 U$1.2
N$66
  Top 0.152: R67.2 11.52,37 11.52,37.38 10.15,38.75 10.15,39.88 10.52,40.25 11.9,40.25 Q2.B
PTA1  (via drill 0.3)
  Top 0.152: v20.77,93.62 20.77,90.12 U1.23 | v21.65,94.5 21.4,94.5 v18.77,97.12
  Bottom 0.152: v21.65,94.5 v20.77,93.62 | v18.77,97.12 18.77,98 18.02,98.75 SWD1.10
RACK_GATE  (via drill 0.3)
  Top 0.152: GATE.SWITCH@2 23.4,31 v25.15,32.75 25.15,36.12 23.4,37.88 23.4,38.75 23.15,39 23.15,43.12 24.65,44.62 24.65,60.5 16.65,68.5 14.65,68.5 13.9,69.25 13.9,75.25 3.15,86 | 3.15,86 4.15,86 U$1.15 | 3.15,86 1.65,86 U$1.16
  Bottom 0.152: v25.15,32.75 23.4,31 GATE.SWITCH@2
REF_-5V  (via drill 0.3)
  Top 0.152: IC4.3 7.52,63.12 7.52,60.12 C16.1 7.4,60 7.02,59.62 7.02,58.5 C14.- 6.9,58.38 v6.9,56.5 | v2.9,50.88 2.27,50.88 | 2.27,50.88 1.15,50.88 R15.2 | v4.15,50.88 4.15,51.25 5.02,52.12 R6.2 5.02,52.25 4.02,53.25 v4.02,53.62 | 2.27,50.88 2.27,47.38 4.9,44.75 10.27,44.75 R3.2 10.4,44.75 11.9,46.25 18.77,46.25 21.02,48.5 21.02,52.62 R4.1
  Bottom 0.152: v4.15,50.88 v2.9,50.88 | v4.02,53.62 v6.9,56.5
SW1  (via drill 0.3)
  Top 0.152: v18.27,89.25 18.27,89 18.65,88.62 19.27,88.62 U1.2 | v17.9,86.38 14.9,83.38 14.15,83.38 v10.4,79.62 | v9.52,78.75 9.52,60 10.4,59.12 10.4,57.62 9.52,56.75 v9.27,56.75 | v6.27,50.38 v6.27,53.75 | 2.27,46.12 2.27,41.12 U$6.1 | 2.27,46.12 8.15,40.25 U$6.2 | 2.27,46.12 v2.27,46.38
  Bottom 0.152: v18.27,89.25 18.27,88.5 18.9,87.88 18.9,87.38 v17.9,86.38 | v9.52,78.75 v10.4,79.62 | v6.27,53.75 v9.27,56.75 | v2.27,46.38 v6.27,50.38
SW2  (via drill 0.3)
  Top 0.152: 19.9,71.25 19.27,71.25 17.77,69.75 U$3.2 | 19.9,71.25 20.52,71.25 R23.1 20.65,71.38 v21.4,72.12 | v26.15,73 31.4,78.25 31.4,82.38 25.27,88.5 23.77,88.5 U1.17 | 19.9,71.25 17.77,73.38 17.77,74.62 U$3.1
  Bottom 0.152: v26.15,73 22.27,73 v21.4,72.12
SW2LED  (via drill 0.3)
  Top 0.152: R22.2 13.65,80 14.4,80.75 v15.77,80.75 | v19.4,84.38 v17.52,82.5 | v24.65,89.62 24.27,89.62 23.77,89.12 U1.18
  Bottom 0.152: v17.52,82.5 v15.77,80.75 | v24.65,89.62 v19.4,84.38
VEE  (via drill 0.3)
  Top 0.152: C4.- 4.77,58 4.15,58.62 4.15,60 C17.1 4.15,60.12 4.15,62.25 5.02,63.12 IC4.2 5.02,63.25 4.9,63.38 v4.9,65.38 | v4.02,66.25 0.4,69.88 0.4,94.12 1.15,94.88 4.65,94.88 5.4,95.62 5.4,99.75 9.15,103.5 10.9,103.5 D2.A
  Bottom 0.152: v4.9,65.38 v4.02,66.25
VIN
  Top 0.152: 7.65,99.25 9.65,99.25 C13.+ 9.77,99.38 10.02,99.62 12.4,99.62 C11.2 12.52,99.62 13.65,98.5 15.27,98.5 IC1.3 | 7.65,99.25 6.65,99.25 D1.C | 7.65,99.25 7.65,94.62 7.4,94.38 7.4,91.75 IC3.3